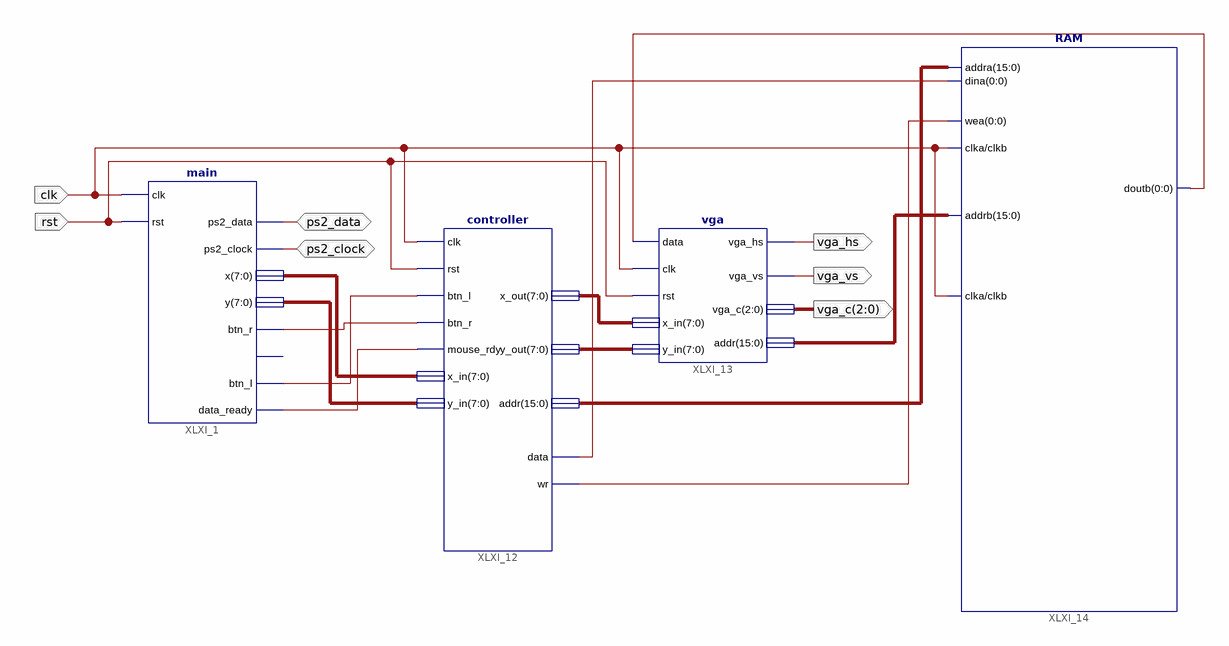
[diagram p0: schematic sheet 1]
// Xilinx ISE schematic mouse_test.sch (spartan3e) as structural Verilog: 4 symbols, 7 ports
module mouse_test (
  input  rst,
  input  clk,
  inout  ps2_data,
  inout  ps2_clock,
  output [2:0] vga_c,
  output vga_vs,
  output vga_hs
);

  wire XLXN_34, XLXN_35, XLXN_36;
  wire [0:0] XLXN_54, XLXN_57, XLXN_58;
  wire [7:0] XLXN_37, XLXN_38, XLXN_47, XLXN_48;
  wire [15:0] XLXN_55, XLXN_56;

  main XLXI_1 (
    .clk(clk), .rst(rst), .ps2_data(ps2_data), .ps2_clock(ps2_clock), .x(XLXN_37), .y(XLXN_38),
    .btn_r(XLXN_35), .btn_l(XLXN_34), .data_ready(XLXN_36));  // open: btn_m
  controller XLXI_12 (
    .clk(clk), .rst(rst), .btn_l(XLXN_34), .btn_r(XLXN_35), .mouse_rdy(XLXN_36), .x_in(XLXN_37),
    .y_in(XLXN_38), .data(XLXN_57[0]), .wr(XLXN_58[0]), .x_out(XLXN_47), .y_out(XLXN_48), .addr(XLXN_56));
  vga XLXI_13 (
    .data(XLXN_54[0]), .clk(clk), .rst(rst), .x_in(XLXN_47), .y_in(XLXN_48), .vga_hs(vga_hs),
    .vga_vs(vga_vs), .vga_c(vga_c), .addr(XLXN_55));
  RAM XLXI_14 (
    .addra(XLXN_56), .dina(XLXN_57[0]), .wea(XLXN_58[0]), .clka(clk), .addrb(XLXN_55), .clkb(clk),
    .doutb(XLXN_54[0]));
endmodule
